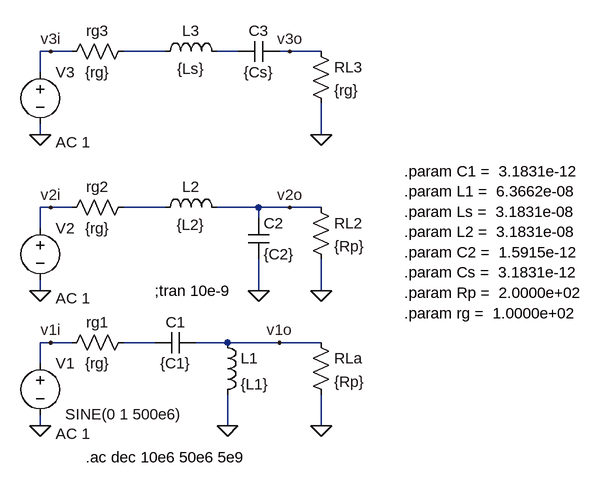
[diagram p0: schematic adaptadorL_ejemplo1.asc]
adaptadorL_ejemplo1.asc, the LTspice schematic file:
Version 4
SHEET 1 900 736
WIRE -192 -352 -208 -352
WIRE -160 -352 -192 -352
WIRE -16 -352 -80 -352
WIRE 96 -352 64 -352
WIRE 176 -352 160 -352
WIRE 224 -352 176 -352
WIRE -208 -320 -208 -352
WIRE -208 -224 -208 -240
WIRE 224 -224 224 -272
WIRE -192 -112 -208 -112
WIRE -160 -112 -192 -112
WIRE -16 -112 -80 -112
WIRE 128 -112 64 -112
WIRE 176 -112 128 -112
WIRE 224 -112 176 -112
WIRE 128 -96 128 -112
WIRE -208 -80 -208 -112
WIRE -208 16 -208 0
WIRE 128 16 128 -32
WIRE 224 16 224 -32
WIRE -192 96 -208 96
WIRE -160 96 -192 96
WIRE -32 96 -80 96
WIRE 80 96 32 96
WIRE 160 96 80 96
WIRE 224 96 160 96
WIRE -208 128 -208 96
WIRE -208 224 -208 208
WIRE 80 224 80 176
WIRE 224 224 224 176
FLAG 224 224 0
FLAG 80 224 0
FLAG -208 224 0
FLAG 224 16 0
FLAG 128 16 0
FLAG -208 16 0
FLAG 160 96 v1o
FLAG 176 -112 v2o
FLAG -192 96 v1i
FLAG -192 -112 v2i
FLAG 224 -224 0
FLAG -208 -224 0
FLAG -192 -352 v3i
FLAG 176 -352 v3o
SYMBOL cap 32 80 R90
WINDOW 0 0 32 VBottom 2
WINDOW 3 32 32 VTop 2
SYMATTR InstName C1
SYMATTR Value {C1}
SYMBOL ind 64 80 R0
SYMATTR InstName L1
SYMATTR Value {L1}
SYMBOL res 208 80 R0
SYMATTR InstName RLa
SYMATTR Value {Rp}
SYMBOL voltage -208 112 R0
WINDOW 3 38 94 Left 2
WINDOW 123 24 124 Left 2
WINDOW 39 0 0 Left 0
SYMATTR InstName V1
SYMATTR Value SINE(0 1 500e6)
SYMATTR Value2 AC 1
SYMBOL res -176 112 R270
WINDOW 0 32 56 VTop 2
WINDOW 3 0 56 VBottom 2
SYMATTR InstName rg1
SYMATTR Value {rg}
SYMBOL res 208 -128 R0
SYMATTR InstName RL2
SYMATTR Value {Rp}
SYMBOL voltage -208 -96 R0
WINDOW 123 24 124 Left 2
WINDOW 39 0 0 Left 0
SYMATTR InstName V2
SYMATTR Value ""
SYMATTR Value2 AC 1
SYMBOL res -176 -96 R270
WINDOW 0 32 56 VTop 2
WINDOW 3 0 56 VBottom 2
SYMATTR InstName rg2
SYMATTR Value {rg}
SYMBOL cap 112 -96 R0
SYMATTR InstName C2
SYMATTR Value {C2}
SYMBOL ind -32 -96 R270
WINDOW 0 32 56 VTop 2
WINDOW 3 5 56 VBottom 2
SYMATTR InstName L2
SYMATTR Value {L2}
SYMBOL res 208 -368 R0
SYMATTR InstName RL3
SYMATTR Value {rg}
SYMBOL voltage -208 -336 R0
WINDOW 123 24 124 Left 2
WINDOW 39 0 0 Left 0
SYMATTR InstName V3
SYMATTR Value ""
SYMATTR Value2 AC 1
SYMBOL res -176 -336 R270
WINDOW 0 32 56 VTop 2
WINDOW 3 0 56 VBottom 2
SYMATTR InstName rg3
SYMATTR Value {rg}
SYMBOL cap 160 -368 R90
WINDOW 0 0 32 VBottom 2
WINDOW 3 32 32 VTop 2
SYMATTR InstName C3
SYMATTR Value {Cs}
SYMBOL ind -32 -336 R270
WINDOW 0 32 56 VTop 2
WINDOW 3 5 56 VBottom 2
SYMATTR InstName L3
SYMATTR Value {Ls}
TEXT -138 272 Left 2 !.ac dec 10e6 50e6 5e9
TEXT -32 16 Left 2 !;tran 10e-9
TEXT 352 -168 Left 2 !.param C1 =  3.1831e-12 \n.param L1 =  6.3662e-08 \n.param Ls =  3.1831e-08 \n.param L2 =  3.1831e-08 \n.param C2 =  1.5915e-12 \n.param Cs =  3.1831e-12 \n.param Rp =  2.0000e+02 \n.param rg =  1.0000e+02

The netlist it stands for:
* adaptadorL_ejemplo1.asc
C1 v1o N004 {C1}
L1 v1o 0 {L1}
RLa v1o 0 {Rp}
V1 v1i 0 SINE(0 1 500e6) AC 1
rg1 v1i N004 {rg}
RL2 v2o 0 {Rp}
V2 v2i 0 AC 1
rg2 v2i N003 {rg}
C2 v2o 0 {C2}
L2 N003 v2o {L2}
RL3 v3o 0 {rg}
V3 v3i 0 AC 1
rg3 v3i N001 {rg}
C3 v3o N002 {Cs}
L3 N001 N002 {Ls}
.ac dec 10e6 50e6 5e9
;tran 10e-9
.param C1 =  3.1831e-12
.param L1 =  6.3662e-08
.param Ls =  3.1831e-08
.param L2 =  3.1831e-08
.param C2 =  1.5915e-12
.param Cs =  3.1831e-12
.param Rp =  2.0000e+02
.param rg =  1.0000e+02
.backanno
.end